# Altium schematic sheet 1608卡-原理图1.SchDoc
size A2
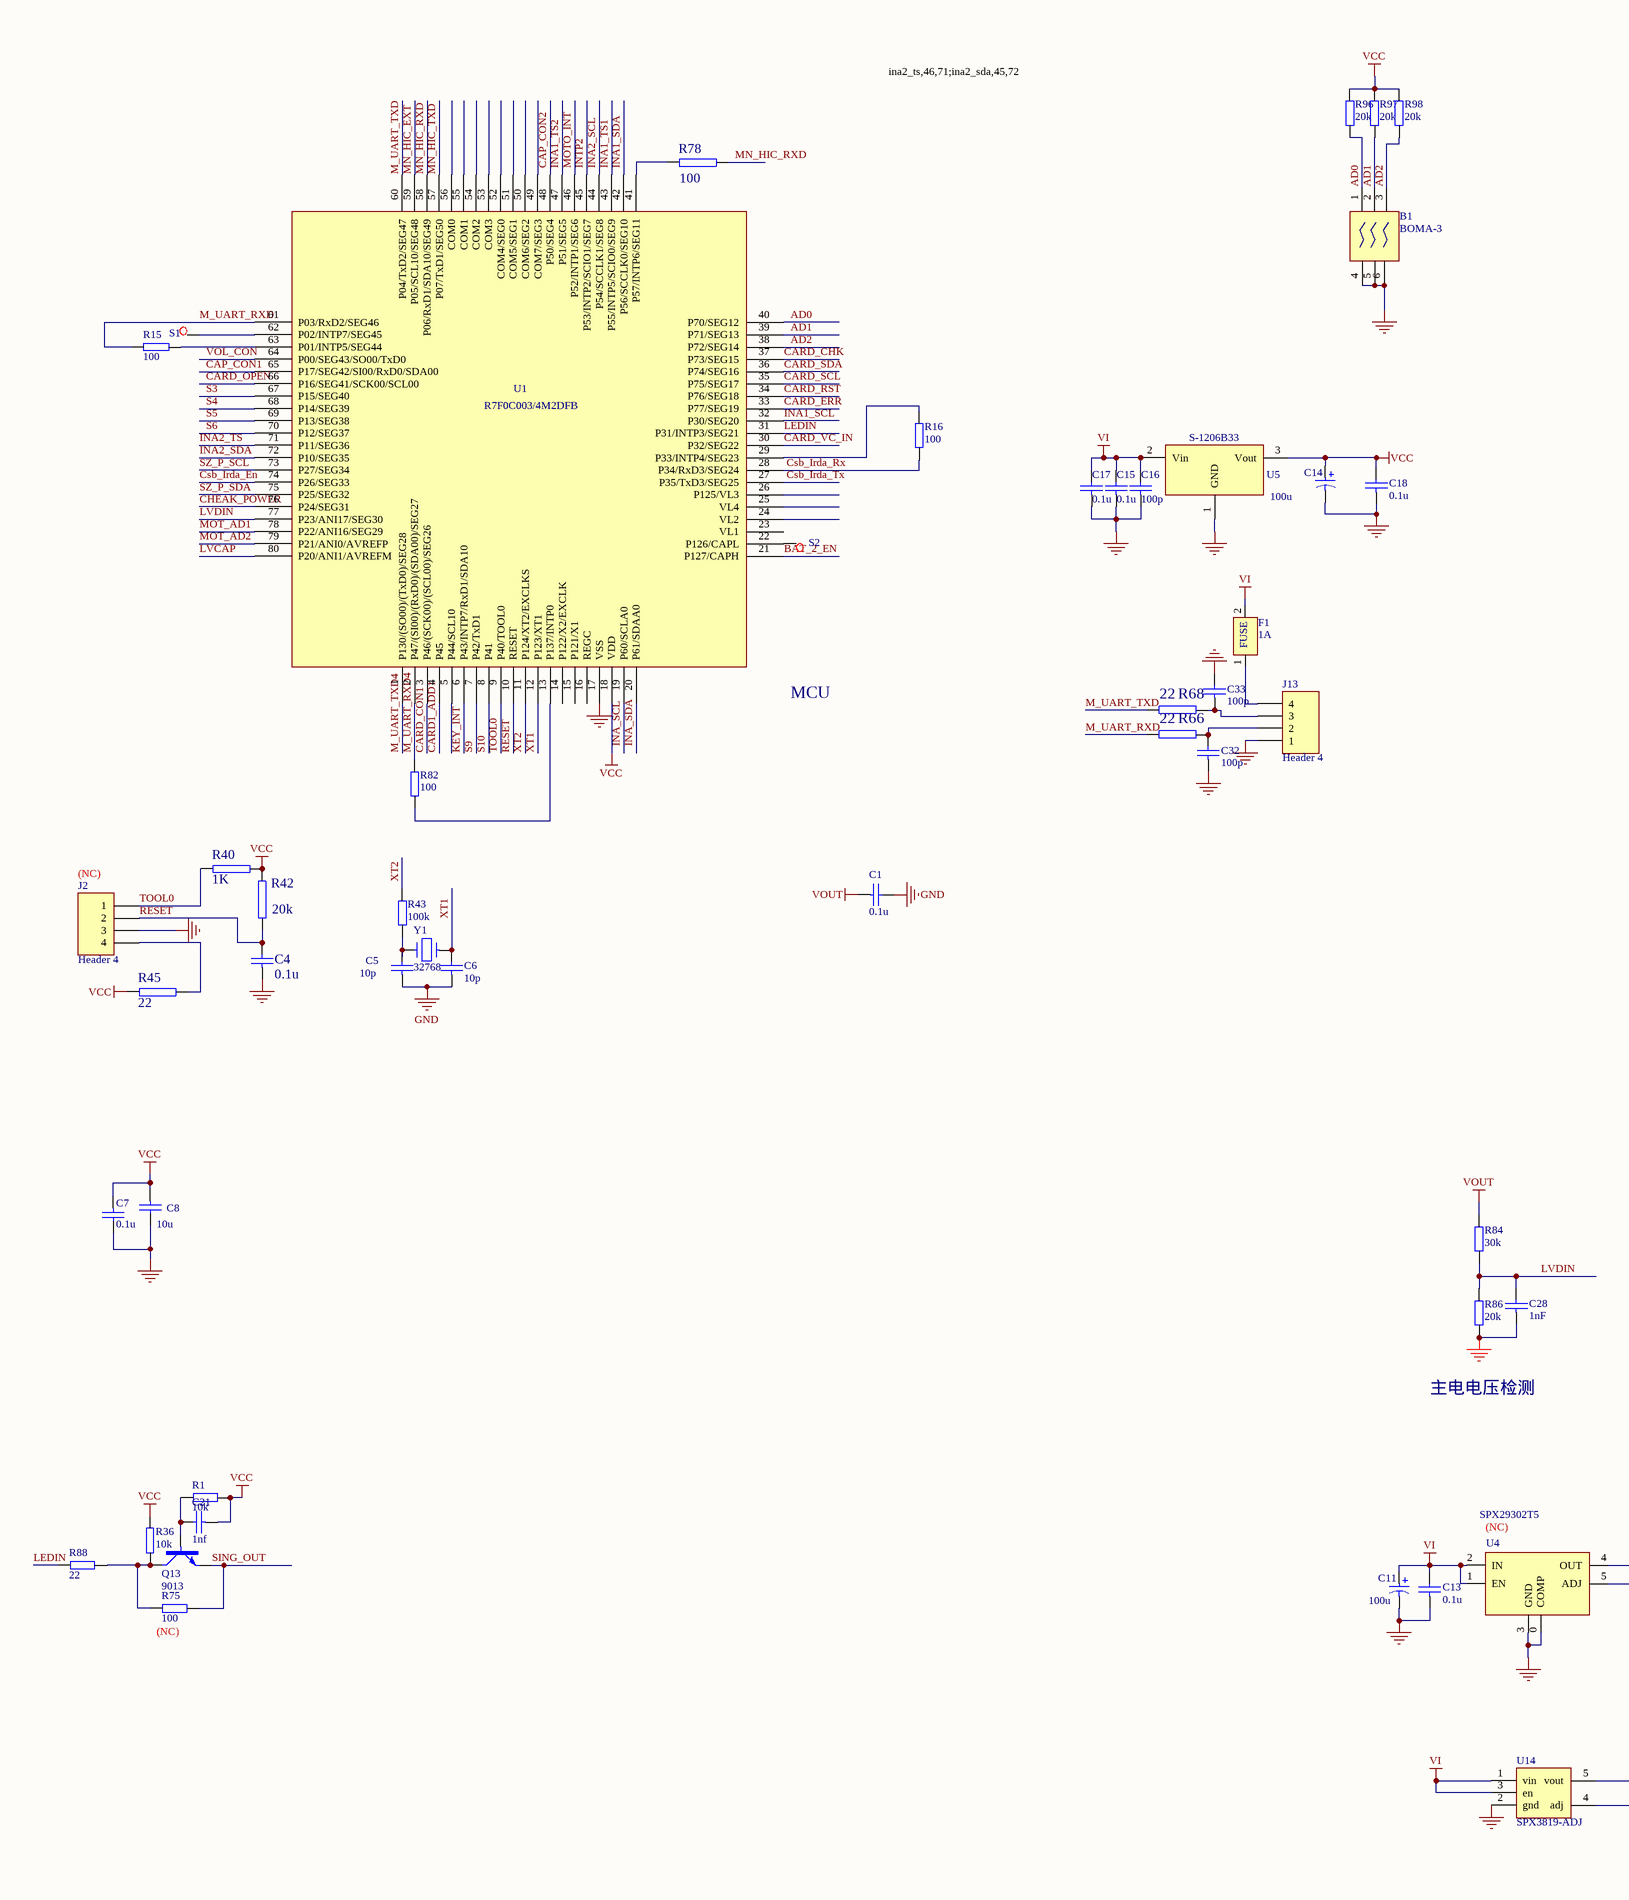
[diagram p0: 1608卡-原理图1.SchDoc, left]
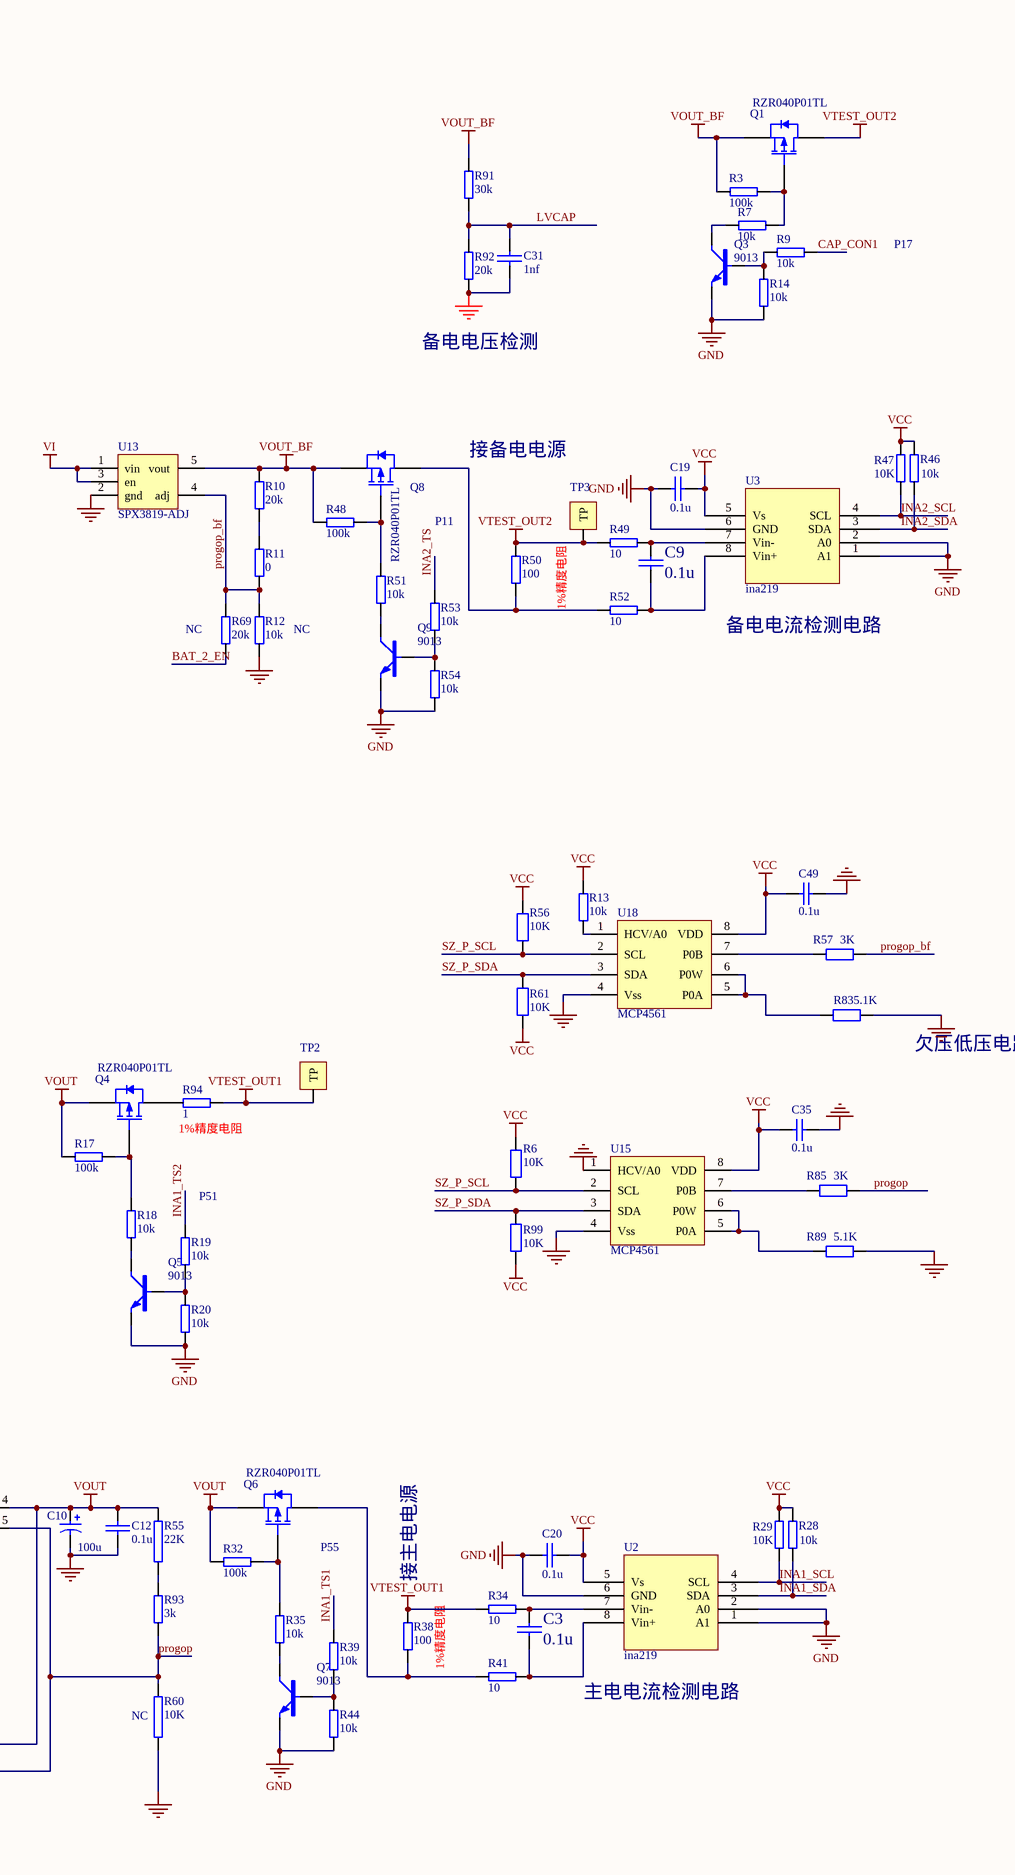
[diagram p1: 1608卡-原理图1.SchDoc, right]

## Parts
B1  BOMA-3  [BOMA-3]
C1  0.1u  [C0603]
C3  0.1u  [C0603]
C4  0.1u  [C0603]
C5  10p  [c0603]
C6  10p  [c0603]
C7  0.1u  [C0603]
C8  10u  [C0603]
C9  0.1u  [C0603]
C10  100u  [3528]
C11  100u  [3528]
C12  0.1u  [C0603]
C13  0.1u  [C0603]
C14  100u  [3528]
C15  0.1u  [C0603]
C16  100p  [C0603]
C17  0.1u  [C0603]
C18  0.1u  [C0603]
C19  0.1u  [C0603]
C20  0.1u  [C0603]
C21  1nf  [C0603]
C28  1nF  [C0603]
C31  1nf  [C0603]
C32  100p  [C0603]
C33  100p  [C0603]
C35  0.1u  [c0603]
C49  0.1u  [c0603]
F1  1A  [R1206]
J2  Header 4  [HDR1X4]
J13  Header 4  [HDX4]
Q1  RZR040P01TL  [SOT-23-MOS]
Q3  9013  [SOT-23-TRAN]
Q4  RZR040P01TL  [SOT-23-MOS]
Q5  9013  [SOT-23-TRAN]
Q6  RZR040P01TL  [SOT-23-MOS]
Q7  9013  [SOT-23-TRAN]
Q8  RZR040P01TL  [SOT-23-MOS]
Q9  9013  [SOT-23-TRAN]
Q13  9013  [SOT-23-TRAN]
R1  10k  [R0603]
R3  100k  [R0603]
R6  10K  [R0603]
R7  10k  [R0603]
R9  10k  [R0603]
R10  20k  [R0603]
R11  0  [R0603]
R12  10k  [R0603]
R13  10k  [R0603]
R14  10k  [R0603]
R15  100  [r0603]
R16  100  [R0603]
R17  100k  [R0603]
R18  10k  [R0603]
R19  10k  [R0603]
R20  10k  [R0603]
R28  10k  [R0603]
R29  10K  [R0603]
R32  100k  [R0603]
R34  10  [R0603]
R35  10k  [R0603]
R36  10k  [R0603]
R38  100  [R1206]
R39  10k  [R0603]
R40  1K  [R0603]
R41  10  [R0603]
R42  20k  [R0603]
R43  100k  [r0603]
R44  10k  [R0603]
R45  22  [R0603]
R46  10k  [R0603]
R47  10K  [R0603]
R48  100k  [R0603]
R49  10  [R0603]
R50  100  [R1206]
R51  10k  [R0603]
R52  10  [R0603]
R53  10k  [R0603]
R54  10k  [R0603]
R55  22K  [R0603]
R56  10K  [R0603]
R57  3K  [R0603]
R60  10K  [R0603]
R61  10K  [R0603]
R66  22  [R0603]
R68  22  [R0603]
R69  20k  [R0603]
R75  100  [R0603]
R78  100  [R0603]
R82  100  [R0603]
R83  5.1K  [R0603]
R84  30k  [R0603]
R85  3K  [R0603]
R86  20k  [R0603]
R88  22  [R0603]
R89  5.1K  [R0603]
R91  30k  [R0603]
R92  20k  [R0603]
R93  3k  [R0603]
R94  1  [R1206]
R96  20k  [R0603]
R97  20k  [R0603]
R98  20k  [R0603]
R99  10K  [R0603]
S1  Test Point  PASS  [TP_S]  (value not drawn)
S2  Test Point  PASS  [TP_S]  (value not drawn)
TP2  TP  [TEST_PAD]  (value not drawn)
TP3  TP  [TEST_PAD]  (value not drawn)
U1  R7F0C003/4M2DFB  [MSP437QFP80]
U2  ina219  [SO-8]
U3  ina219  [SO-8]
U4  SPX29302T5  [TO-263-5]
U5  S-1206B33  [SOT-89]
U13  SPX3819-ADJ  [SOT23-5]
U14  SPX3819-ADJ  [SOT23-5]
U15  MCP4561  [MSOP]
U18  MCP4561  [MSOP]
Y1  32768  [XTAL-2S]

## Nets
GND: B1.4(vout) B1.5(vout) B1.6(vout) C1.2 C4.1 C5.1 C6.1 C7.2 C8.2 C10.2 C11.2 C12.1 C13.1 C14.2 C15.1 C16.1 C17.1 C18.1 C19.1 C20.1 C28.1 C31.1 C32.1 C33.2 C35.2 C49.2 J2.3 J13.1 Q3.E Q5.E Q7.E Q9.E R12.1 R14.2 R20.2 R44.2 R54.2 R60.2 R83.1 R86.2 R89.1 R92.2 U1.17(VSS) U2.1(A1) U2.2(A0) U2.6(GND) U3.1(A1) U3.2(A0) U3.6(GND) U4.0(COMP) U4.3(GND) U5.1(GND) U13.2(gnd) U14.2(gnd) U15.1(HCV/A0) U15.4(Vss) U18.4(Vss)
VCC: C7.1 C8.1 C14.1 C18.2 C19.2 C20.2 C21.1 C35.1 C49.1 R1.2 R6.1 R13.1 R28.2 R29.2 R36.2 R40.2 R42.1 R45.1 R46.2 R47.2 R56.1 R61.2 R96.2 R97.2 R98.2 R99.2 U1.18(VDD) U2.5(Vs) U3.5(Vs) U5.3(Vout) U15.8(VDD) U18.8(VDD)
VI: C11.1 C13.2 C15.2 C16.2 C17.2 F1.2(I) U4.1(EN) U4.2(IN) U5.2(Vin) U13.1(vin) U13.3(en) U14.1(vin) U14.3(en)
VOUT: C1.1 C10.1 C12.2 Q4.S Q6.S R17.2 R32.2 R55.1 R84.1 U4.4(OUT) U14.5(vout)
VOUT_BF: Q1.S Q8.S R3.2 R10.2 R48.2 R91.1 U13.5(vout)
VTEST_OUT1: R34.2 R38.1 R94.1 TP2.1(TP)
VTEST_OUT2: Q1.D R49.2 R50.1 TP3.1(TP)
AD0: B1.1(vout) R96.1 U1.40(P70/SEG12)
AD1: B1.2(vout) R97.1 U1.39(P71/SEG13)
AD2: B1.3(vout) R98.1 U1.38(P72/SEG14)
BAT_2_EN: R69.2 U1.21(P127/CAPH)
CAP_CON1: R9.2 U1.65(P17/SEG42/SI00/RxD0/SDA00)
CAP_CON2: U1.48(P50/SEG4)
CARD1_ADD1: U1.4(P45)
CARD_CHK: U1.37(P73/SEG15)
CARD_CON1: U1.3(P46/(SCK00)/(SCL00)/SEG26)
CARD_ERR: U1.33(P77/SEG19)
CARD_OPEN: U1.66(P16/SEG41/SCK00/SCL00)
CARD_RST: U1.34(P76/SEG18)
CARD_SCL: U1.35(P75/SEG17)
CARD_SDA: U1.36(P74/SEG16)
CARD_VC_IN: U1.30(P32/SEG22)
CHEAK_POWER: U1.76(P24/SEG31)
Csb_Irda_En: U1.74(P26/SEG33)
Csb_Irda_Rx: R16.1 U1.28(P34/RxD3/SEG24)
Csb_Irda_Tx: U1.27(P35/TxD3/SEG25)
INA1_SCL: R29.1 U1.32(P30/SEG20) U2.4(SCL)
INA1_SDA: R28.1 U1.42(P56/SCCLK0/SEG10) U2.3(SDA)
INA1_TS1: R39.2 U1.43(P55/INTP5/SCIO0/SEG9)
INA1_TS2: R19.2 U1.47(P51/SEG5)
INA2_SCL: R47.1 U1.44(P54/SCCLK1/SEG8) U3.4(SCL)
INA2_SDA: R46.1 U1.72(P10/SEG35) U3.3(SDA)
INA2_TS: R53.2 U1.71(P11/SEG36)
INA_SCL: U1.19(P60/SCLA0)
INA_SDA: U1.20(P61/SDAA0)
INTP2: U1.45(P53/INTP2/SCIO1/SEG7)
KEY_INT: U1.6(P43/INTP7/RxD1/SDA10)
LEDIN: R88.1 U1.31(P31/INTP3/SEG21)
LVCAP: C31.2 R91.2 R92.1 U1.80(P20/ANI1/AVREFM)
LVDIN: C28.2 R84.2 R86.1 U1.77(P23/ANI17/SEG30)
M_UART_RXD: R15.2 R66.2 U1.61(P03/RxD2/SEG46)
M_UART_RXD4: R82.2 U1.2(P47/(SI00)/(RxD0)/(SDA00)/SEG27)
M_UART_TXD: R68.2 U1.60(P04/TxD2/SEG47)
M_UART_TXD4: U1.1(P130/(SO00)/(TxD0)/SEG28)
MN_HIC_EXT: U1.59(P05/SCL10/SEG48)
MN_HIC_RXD: R78.2 U1.58(P06/RxD1/SDA10/SEG49)
MN_HIC_TXD: U1.57(P07/TxD1/SEG50)
MOT_AD1: U1.78(P22/ANI16/SEG29)
MOT_AD2: U1.79(P21/ANI0/AVREFP)
MOTO_INT: U1.46(P52/INTP1/SEG6)
progop: R60.1 R85.1 R93.2 U4.5(ADJ) U14.4(adj)
progop_bf: R11.1 R12.2 R57.1 R69.1 U13.4(adj)
RESET: C4.2 J2.2 R42.2 U1.10(RESET)
S3: U1.67(P15/SEG40)
S4: U1.68(P14/SEG39)
S5: U1.69(P13/SEG38)
S6: U1.70(P12/SEG37)
S9: U1.7(P42/TxD1)
S10: U1.8(P41)
SING_OUT: Q13.E R75.1
SZ_P_SCL: R6.2 R56.2 U1.73(P27/SEG34) U15.2(SCL) U18.2(SCL)
SZ_P_SDA: R61.1 R99.1 U1.75(P25/SEG32) U15.3(SDA) U18.3(SDA)
TOOL0: J2.1 R40.1 U1.9(P40/TOOL0)
VOL_CON: U1.64(P00/SEG43/SO00/TxD0)
XT1: C6.2 U1.12(P123/XT1) Y1.1
XT2: R43.2 U1.11(P124/XT2/EXCLKS)
NetC3_1: C3.1 R34.1 U2.7(Vin-)
NetC3_2: C3.2 R41.1 U2.8(Vin+)
NetC5_2: C5.2 R43.1 Y1.2
NetC9_1: C9.1 R49.1 U3.7(Vin-)
NetC9_2: C9.2 R52.1 U3.8(Vin+)
NetC21_2: C21.2 Q13.B R1.1
NetC32_2: C32.2 J13.2 R66.1
NetC33_1: C33.1 J13.3 R68.1
NetF1_1: F1.1(I) J13.4
NetJ2_4: J2.4 R45.2
NetQ1_G: Q1.G R3.1 R7.2
NetQ3_B: Q3.B R9.1 R14.1
NetQ3_C: Q3.C R7.1
NetQ4_D: Q4.D R94.2
NetQ4_G: Q4.G R17.1 R18.2
NetQ5_B: Q5.B R19.1 R20.1
NetQ5_C: Q5.C R18.1
NetQ6_D: Q6.D R38.2 R41.2
NetQ6_G: Q6.G R32.1 R35.2
NetQ7_B: Q7.B R39.1 R44.1
NetQ7_C: Q7.C R35.1
NetQ8_D: Q8.D R50.2 R52.2
NetQ8_G: Q8.G R48.1 R51.2
NetQ9_B: Q9.B R53.1 R54.1
NetQ9_C: Q9.C R51.1
NetQ13_C: Q13.C R36.1 R75.2 R88.2
NetR10_1: R10.1 R11.2
NetR13_2: R13.2 U18.1(HCV/A0)
NetR15_1: R15.1 U1.63(P01/INTP5/SEG44)
NetR16_2: R16.2 U1.29(P33/INTP4/SEG23)
NetR55_2: R55.2 R93.1
NetR57_2: R57.2 U18.7(P0B)
NetR78_1: R78.1 U1.41(P57/INTP6/SEG11)
NetR82_1: R82.1 U1.13(P137/INTP0)
NetR83_2: R83.2 U18.5(P0A) U18.6(P0W)
NetR85_2: R85.2 U15.7(P0B)
NetR89_2: R89.2 U15.5(P0A) U15.6(P0W)
NetS1_1: S1.1 U1.62(P02/INTP7/SEG45)
NetS2_1: S2.1 U1.22(P126/CAPL)

Not connected (* = marked no-connect by the designer): U1 5(P44/SCL10) 14(P122/X2/EXCLK) 15(P121/X1) 16(REGC) 23(VL1) 24(VL2) 25(VL4) 26(P125/VL3) 49(COM7/SEG3) 50(COM6/SEG2) 51(COM5/SEG1) 52(COM4/SEG0) 53(COM3) 54(COM2) 55(COM1) 56(COM0)

## Notes on the sheet
- ina2_ts,46,71;ina2_sda,45,72
- P17
- 备电电压检测
- 接备电电源
- P11
- (near U1) MCU
- 1%精度电阻
- (near R69) NC
- (near R12) NC
- 备电电流检测电路
- (near J2) (NC)
- 欠压低压电路
- (near R94) 1%精度电阻
- (near R19) P51
- 主电电压检测
- (near U4) (NC)
- (near Q6) P55
- (near R75) (NC)
- (near R38) 接主电电源
- (near R60) NC
- 主电电流检测电路

## Library data of the parts
C1 C7 C8 C12 C13 C15-C21 C28 C31-C33 = CAP: 无极性电容
C3 C9 = Pro28.tmp_UnNamed_45
C4 = CAP: Capacitor
C5 C6 = CAP1
C10 C11 C14 = CAP-POL2: 钽电容
C35 C49 = Cap: Capacitor; Value: 104; Published: 8-Jun-2000; LatestRevisionDate: 17-Jul-2002; LatestRevisionNote: Re-released for DXP Platform.; PackageReference: RAD-0.3; Publisher: Altium Limited
F1 = FUSE
J2 J13 = Header 4: Header, 4-Pin; LatestRevisionDate: 17-Jul-2002; LatestRevisionNote: Re-released for DXP Platform.; Publisher: Altium Limited
Q1 Q4 Q6 Q8 = MOS-P: P-channel  MOSFET
Q3 Q5 Q7 Q9 Q13 = NPN-S: NPN Transistor
R1 R36 R75 R88 = RES  PASS
R3 R7 R9-R20 R28 R29 R32 R34 R35 R38 R39 R41 R43 R44 R46-R54 R69 R82 R84 R86 R91-R94 R96-R98 = RES
R6 R56 R61 R83 R89 R99 = Res2: Resistor; Value: 750; Published: 8-Jun-2000; LatestRevisionDate: 17-Jul-2002; LatestRevisionNote: Re-released for DXP Platform.; PackageReference: AXIAL-0.4; Publisher: Altium Limited
R40 R42 R45 R78 = RES11
R55 R60 R66 R68 = RES2
R57 R85 = Res2: Resistor; Value: 1.8K; Published: 8-Jun-2000; LatestRevisionDate: 17-Jul-2002; LatestRevisionNote: Re-released for DXP Platform.; PackageReference: AXIAL-0.4; Publisher: Altium Limited
S1 S2 = Test Point  PASS: 测试点
U2 U3 = Component_2
U4 = SPX29302T5: Value: 1K; Published: 8-Jun-2000; LatestRevisionDate: 04-Mar-2005; LatestRevisionNote: PCB Footprint replaced.; PackageReference: J1-0603; Publisher: Altium Limited
U5 = VOLTRER1
Y1 = XTAL1: 晶振,2PIN